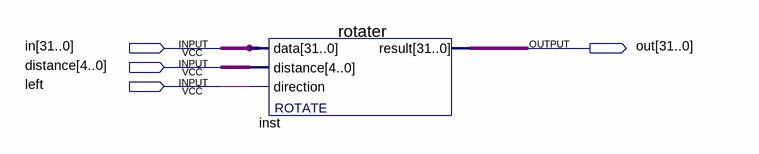
[diagram p0: schematic sheet]
// Quartus schematic rotate.bdf as structural Verilog: 1 symbols, 4 pins
module rotate (
  input  [31:0] in,
  input  [4:0] distance,
  input  left,
  output [31:0] out
);

  rotater inst (.data(in), .distance(distance), .direction(left), .result(out));
endmodule
